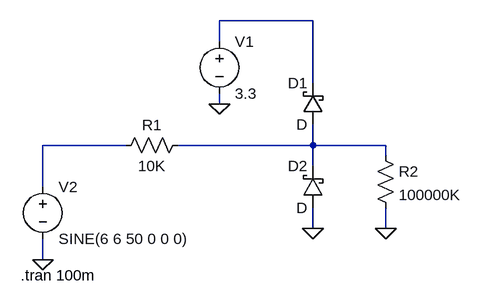
[diagram p0: schematic simulacion-clamping-diodes.asc]
simulacion-clamping-diodes.asc, the LTspice schematic file:
Version 4
SHEET 1 880 680
WIRE 192 16 48 16
WIRE 48 48 48 16
WIRE 192 112 192 16
WIRE 48 144 48 128
WIRE -96 208 -224 208
WIRE 192 208 192 176
WIRE 192 208 -16 208
WIRE 304 208 192 208
WIRE 304 224 304 208
WIRE 192 240 192 208
WIRE -224 272 -224 208
WIRE 192 336 192 304
WIRE 304 336 304 304
WIRE -224 384 -224 352
FLAG 192 336 0
FLAG 48 144 0
FLAG -224 384 0
FLAG 304 336 0
SYMBOL schottky 208 176 R180
WINDOW 0 24 64 Left 2
WINDOW 3 24 0 Left 2
SYMATTR InstName D1
SYMBOL schottky 208 304 R180
WINDOW 0 24 64 Left 2
WINDOW 3 24 0 Left 2
SYMATTR InstName D2
SYMBOL voltage 48 32 R0
WINDOW 123 0 0 Left 0
WINDOW 39 0 0 Left 0
SYMATTR InstName V1
SYMATTR Value 3.3
SYMBOL res 0 192 R90
WINDOW 0 0 56 VBottom 2
WINDOW 3 32 56 VTop 2
SYMATTR InstName R1
SYMATTR Value 10K
SYMBOL voltage -224 256 R0
WINDOW 123 0 0 Left 0
WINDOW 39 0 0 Left 0
SYMATTR InstName V2
SYMATTR Value SINE(6 6 50 0 0 0)
SYMBOL res 288 208 R0
SYMATTR InstName R2
SYMATTR Value 100000K
TEXT -258 408 Left 2 !.tran 100m

The netlist it stands for:
* simulacion-clamping-diodes.asc
D1 N003 N001 D
D2 0 N003 D
V1 N001 0 3.3
R1 N003 N002 10K
V2 N002 0 SINE(6 6 50 0 0 0)
R2 N003 0 100000K
.model D D
.lib standard.dio
.tran 100m
.backanno
.end